# Altium project Neo-7M GNSS Evaluation Board.PrjPcb
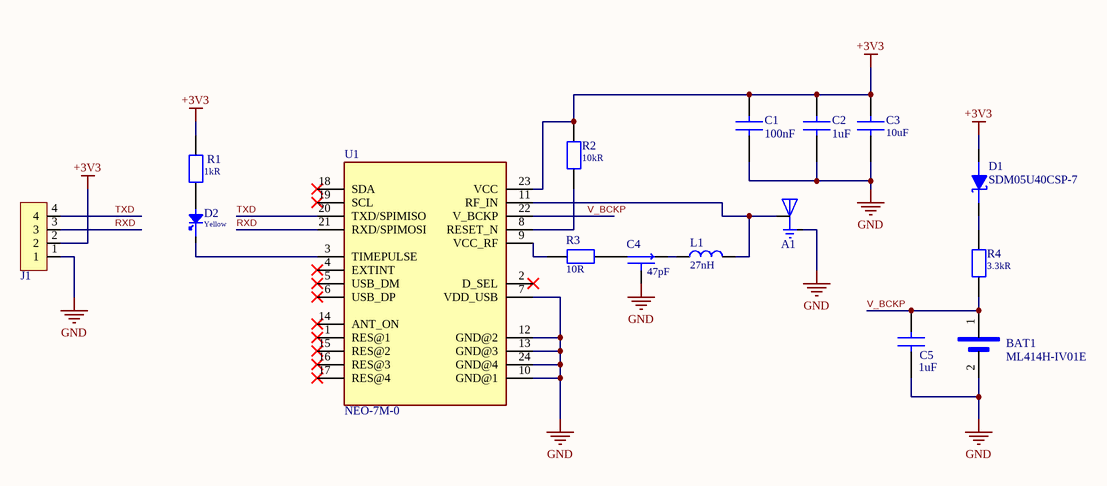
[diagram p0: NEO7M_EVAL.SchDoc]
1 sheet, 16 parts. Net scope: global (net labels, ports and power ports of the same name join across sheets).
Board file: NEO7M_EVAL.PcbDoc

## Sheet NEO7M_EVAL.SchDoc: NEO7M_SIMPLE
size A3; SheetNumber: 1; SheetTotal: 1

### Parts
A1  U.FL-R-SMT-1(10)  [HRS_U.FL-R-SMT-1(10)]  (value not drawn)
BAT1  ML414H-IV01E  [ML414H-IV01E]
C1  Capacitance: 100nF  [CAP CER 0603]  (hidden comment: C0603C104K5RAC7082)
C2  Capacitance: 1uF  [CAP CER 0805]  (hidden comment: CL21B105KOFNFNE)
C3  Capacitance: 10uF  [CAP CER 0805]  (hidden comment: GRM21BR61E106MA73L)
C4  Capacitance: 47pF  [CAP FEEDTRU 0805]  (hidden comment: W2F11A4708AT1A)
C5  Capacitance: 1uF  [CAP CER 0805]  (hidden comment: CL21B105KOFNFNE)
D1  SDM05U40CSP-7  [SDM05U40CSP-7]
D2  Color: Yellow  [LED GR 0603]  (hidden comment: APTD1608LSYCK/J3-PF)
J1  M20-9730445  [HDR_ML_1X4]  (value not drawn)
L1  Inductance: 27nH  [IND 0402]  (hidden comment: LQG15HS27NJ02D)
R1  Resistance: 1kR  [RES 0603]  (hidden comment: RC0603FR-071KL)
R2  Resistance: 10kR  [RES 0603]  (hidden comment: RC0603FR-0710KL)
R3  Resistance: 10R  [Res 0402]  (hidden comment: RK73H1ERTTP10R0F)
R4  Resistance: 3.3kR  [RES 0603]  (hidden comment: RC0603FR-073K3L)
U1  NEO-7M-0  [NEO-7M-0]

### Nets
+3V3: C1.2 C2.2 C3.2 D1.A J1.2 R1.2 R2.2 U1.23(VCC)
GND: A1.GND BAT1.2(NEG) C1.1 C2.1 C3.1 C4.3 C5.1 J1.1 U1.7(VDD_USB) U1.10(GND@1) U1.12(GND@2) U1.13(GND@3) U1.24(GND@4)
RXD: J1.3 U1.21(RXD/SPIMOSI)
TXD: J1.4 U1.20(TXD/SPIMISO)
V_BCKP: BAT1.1(POS) C5.2 R4.1 U1.22(V_BCKP)
NetA1_SIG: A1.SIG L1.2 U1.11(RF_IN)
NetC4_1: C4.1 R3.2
NetC4_2: C4.2 L1.1
NetD1_C: D1.C R4.2
NetD2_1: D2.1 U1.3(TIMEPULSE)
NetD2_2: D2.2 R1.1
NetR2_1: R2.1 U1.8(RESET_N)
NetR3_1: R3.1 U1.9(VCC_RF)

Not connected (* = marked no-connect by the designer): U1 1(RES@1)* 2(D_SEL)* 4(EXTINT)* 5(USB_DM)* 6(USB_DP)* 14(ANT_ON)* 15(RES@2)* 16(RES@3)* 17(RES@4)* 18(SDA)* 19(SCL)*

### Notes on the sheet
- ~
- Designed By:
- Page Name:
- Title:
- Variant:
- Page Size:
- Company:
- ApprovedBy:
- Date:
- Sheet:
- Revision:
- of

### Library data of the parts
A1 = U.FL-R-SMT-1(10): HIROSE(HRS) - U.FL-R-SMT-1(10) - RF COAXIAL, U.FL, STRAIGHT JACK, 50OHM; Body Material: Bronze; Body Plating: Silver; Dielectric Material: Polymer; Impedance: 50R; Connector Type: Coaxial,Receptacle,Male Pin; Frequency: 6GHz; Insulation Resistance: 500MR; Gender: Male; Supplier 1: Digi-Key; Manufacturer: Hirose; Manufacturer Part Number: U.FL-R-SMT-1(10); RoHS: Yes; Category: RF / Coaxial Connectors; Stock 1: 24998; Pricing 1: 2500=0.62974, 5000=0.60802, 12500=0.56459 (USD); Mount: Surface Mount,Through Hole,PCB; Contact Material: Brass,Bronze; Contact Plating: Gold; Housing Color: Beige; Min Operating Temperature: -40°C; Max Operating Temperature: 90°C; Termination: Solder; Orientation: Straight; Packaging: Tape and Reel; Package Quantity: 2500; Fastening Type: Snap; Max Frequency: 6GHz; Wire/Cable Type: Coaxial; Length: 3mm; Depth: 3.1mm; Radiation Hardening: No; REACH SVHC: No SVHC; Lead Free: Lead Free; ComponentLink1URL: https://datasheet.ciiva.com/11762/0900766b8105243f-11762474.pdf?src-supplier=RSComponents; ComponentLink1Description: https://datasheet.ciiva.com/11762/0900766b8105243f-11762474.pdf?src-supplier=RSComponents; ComponentLink2URL: https://datasheet.ciiva.com/7651/91524-7651914.pdf?src-supplier=Element14; ComponentLink2Description: https://datasheet.ciiva.com/7651/91524-7651914.pdf?src-supplier=Element14; ComponentLink3URL: https://datasheet.ciiva.com/7651/91524-7651915.pdf?src-supplier=Element14; ComponentLink3Description: https://datasheet.ciiva.com/7651/91524-7651915.pdf?src-supplier=Element14; Supplier Part Number 1: H11891TR-ND
BAT1 = ML414H-IV01E: BATTERY LITHIUM 3V RECHARGE; Manufacturer: Seiko; Supplier 1: Mouser; Manufacturer Part Number: ML414H-IV01E; RoHS: Yes; Category: Batteries and Accessories; Stock 1: 5581; Pricing 1: 1=1.82000, 10=1.63000, 50=1.45000, 100=1.27000, 1000=0.96600, 10000=0.81500 (USD); Weight: 0.007; Termination: SMD/SMT; Package Quantity: 1; Voltage Rating: 3V; Packaging: Tape and Reel; ComponentLink1URL: https://datasheet.ciiva.com/3/ml414h-e-3633.pdf?src-supplier=Digi-Key; ComponentLink1Description: https://datasheet.ciiva.com/3/ml414h-e-3633.pdf?src-supplier=Digi-Key; ComponentLink2URL: https://datasheet.ciiva.com/3/ml414h-e-3634.pdf?src-supplier=Digi-Key; ComponentLink2Description: https://datasheet.ciiva.com/3/ml414h-e-3634.pdf?src-supplier=Digi-Key; Supplier Part Number 1: 628-ML414H-IV01E
C1 = CAP CER 0.1UF 50V 0603: Cap Cer 0.1uF 50V 0603 10%; Manufacturer: KEMET; Dielectric Material: Ceramic; Dielectric: X7R; DesignedBy: ENES MERCAN; Supplier 1: Digi-Key; Manufacturer Part Number: C0603C104K5RAC7082; RoHS: Yes; Category: Ceramic Capacitors; Stock 1: 44787; Pricing 1: 1=0.12000, 10=0.08900, 50=0.04840, 100=0.03940, 500=0.02818, 1000=0.02214, 2500=0.02012, 5000=0.01852 (USD); Case/Package: 0603; Voltage Rating (DC): 50V; Tolerance: 10%; RoHS Compliant: Yes; Supplier Part Number 1: 399-C0603C104K5RAC7082CT-ND; Weight: 0.063
C2 C5 = CAP CER 1UF 16V 0805: CAP CER 1UF 16V X7R 0805; Manufacturer: Samsung; Tolerance: 10%; Supplier 1: Digi-Key; Manufacturer Part Number: CL21B105KOFNFNE; RoHS: Yes; Category: Ceramic Capacitors; Stock 1: 73789; Pricing 1: 1=0.12000, 10=0.08900, 50=0.04840, 100=0.03940, 500=0.02818, 1000=0.02214 (USD); Mount: Surface Mount; Case/Package: 0805; Case Code (Metric): 2012; Case Code (Imperial): 0805; Contact Plating: Tin; Min Operating Temperature: -55°C; Max Operating Temperature: 125°C; Package Quantity: 1; Packaging: Tape and Reel; Voltage Rating: 16V; Dielectric: X7R; Termination: Wraparound; Series: CL; Construction: Flat; Length: 0.079inch; Width: 0.049inch; Thickness: 0.053inch; RoHS Compliant: Yes; ComponentLink1URL: https://datasheet.ciiva.com/25713/cl21b105kofnfne-25713075.pdf?src-supplier=Digi-Key; ComponentLink1Description: https://datasheet.ciiva.com/25713/cl21b105kofnfne-25713075.pdf?src-supplier=Digi-Key; Supplier Part Number 1: 1276-2930-1-ND
C3 = CAP CER 10UF 25V 0805: MURATA - GRM21BR61E106MA73L - SMD Multilayer Ceramic Capacitor, 10 µF, 25 V, 0805 [2012 Metric], ± 20%, X5R, GRM Series; Voltage Rating: 25V; Supplier 1: Digi-Key; Manufacturer: Murata; Manufacturer Part Number: GRM21BR61E106MA73L; RoHS: Yes; Category: Ceramic Capacitors; Stock 1: 318119; Pricing 1: 1=0.26000, 10=0.17900, 50=0.11960, 100=0.10170, 500=0.07176, 1000=0.06279 (USD); Mount: Surface Mount; Case/Package: 0805; Case Code (Metric): 2012; Case Code (Imperial): 0805; Weight: 0.000335oz; Min Operating Temperature: -55°C; Max Operating Temperature: 85°C; Tolerance: 20%; Packaging: Tape and Reel; Dielectric: X5R; Termination: SMD/SMT; Resistor Type: Ceramic; Voltage Rating (DC): 25V; Package Quantity: 3000; Length: 2mm; Width: 0.049inch; Height: 1.25mm; Thickness: 0.055inch; Depth: 1.25mm; REACH SVHC: No SVHC; Lead Free: Lead Free; RoHS Compliant: Yes; ComponentLink1URL: http://www.farnell.com/datasheets/2079185.pdf?src-supplier=Farnell; ComponentLink1Description: http://www.farnell.com/datasheets/2079185.pdf?src-supplier=Farnell; ComponentLink2URL: http://www.mouser.com/ds/2/281/c02e-2905.pdf?src-supplier=Mouser; ComponentLink2Description: http://www.mouser.com/ds/2/281/c02e-2905.pdf?src-supplier=Mouser; ComponentLink3URL: http://components.arrow.com/part/dataview/0323_03061623?src-supplier=Arrow+Europe; ComponentLink3Description: http://components.arrow.com/part/dataview/0323_03061623?src-supplier=Arrow+Europe; ComponentLink4URL: https://search.murata.co.jp/Ceramy/image/img/A01X/G101/ENG/GRM21BR61E106MA73-01.pdf?src-supplier=Digi-Key; ComponentLink4Description: https://search.murata.co.jp/Ceramy/image/img/A01X/G101/ENG/GRM21BR61E106MA73-01.pdf?src-supplier=Digi-Key; ComponentLink5URL: http://www.farnell.com/datasheets/2079185.pdf?src-supplier=Element14; ComponentLink5Description: http://www.farnell.com/datasheets/2079185.pdf?src-supplier=Element14; Supplier Part Number 1: 490-10748-1-ND
C4 = CAP FT 47PF 100V 0805: CAP FEEDTHRU 47PF 100V 0805; Manufacturer: Kyocera AVX; Dielectric Material: Ceramic; Tolerance: 50%; Dielectric: C0G; Current Rating: 300mA; DC Resistance (DCR): 600mR; Insulation Resistance: 1GR; Supplier 1: Digi-Key; Manufacturer Part Number: W2F11A4708AT1A; RoHS: Yes; Category: Ceramic Capacitors; Stock 1: 19900; Pricing 1: 1=0.46000, 10=0.32200, 50=0.24380, 100=0.21240, 500=0.15730, 1000=0.13370 (USD); Mount: Surface Mount; Case/Package: 0805; Number of Pins: 4; Case Code (Metric): 2012; Case Code (Imperial): 0805; Min Operating Temperature: -55°C; Max Operating Temperature: 125°C; Voltage Rating: 100V; Package Quantity: 4000; Packaging: Tape and Reel; Voltage Rating (DC): 100V; Voltage: 100V; Current: 300mA; Termination: SMD/SMT; Series: W2F; Construction: Flat; Length: 2.01mm; Width: 0.049inch; Height: 0.045inch; Depth: 1.25mm; Radiation Hardening: No; Lead Free: Lead Free; RoHS Compliant: Yes; ComponentLink1URL: https://datasheet.ciiva.com/1011/w2fw3f-1011555.pdf?src-supplier=Digi-Key; ComponentLink1Description: https://datasheet.ciiva.com/1011/w2fw3f-1011555.pdf?src-supplier=Digi-Key; ComponentLink2URL: https://datasheet.ciiva.com/17490/w2fw3f-17490408.pdf?src-supplier=Avnet+Europe; ComponentLink2Description: https://datasheet.ciiva.com/17490/w2fw3f-17490408.pdf?src-supplier=Avnet+Europe; ComponentLink3URL: https://datasheet.ciiva.com/4932/w2fw3f-4932074.pdf?src-supplier=Mouser; ComponentLink3Description: https://datasheet.ciiva.com/4932/w2fw3f-4932074.pdf?src-supplier=Mouser; ComponentLink4URL: https://datasheet.ciiva.com/11516/w2fw3f-11516952.pdf?src-supplier=Avnet; ComponentLink4Description: https://datasheet.ciiva.com/11516/w2fw3f-11516952.pdf?src-supplier=Avnet; Supplier Part Number 1: 478-12987-1-ND
D1 = Schottky Diode GPS: DIODE SCHTKY 40V 500MA X3WLB1006; Manufacturer: Diodes; Capacitance: 3.5E-11F; Element Configuration: Single; Forward Voltage: 460mV; Max Forward Surge Current (Ifsm): 14A; Max Reverse Current: 75uA; Supplier 1: Digi-Key; Manufacturer Part Number: SDM05U40CSP-7; RoHS: Yes; Category: Rectifier Diodes; Stock 1: 221856; Pricing 1: 1=0.41000, 10=0.30800, 100=0.17440, 500=0.11550, 1000=0.08855, 2000=0.07700 (USD); Mount: Surface Mount; Number of Pins: 2; Min Operating Temperature: -55°C; Max Operating Temperature: 150°C; Packaging: Tape and Reel; Reverse Voltage (DC): 40V; Average Rectified Current: 500mA; Forward Current: 500mA; Max Repetitive Reverse Voltage (Vrrm): 40V; Package Quantity: 5000; Max Reverse Voltage (DC): 40V; RoHS Compliant: Yes; ComponentLink1URL: http://www.mouser.com/ds/2/115/SDM05U40CSP-520315.pdf?src-supplier=Mouser; ComponentLink1Description: http://www.mouser.com/ds/2/115/SDM05U40CSP-520315.pdf?src-supplier=Mouser; ComponentLink2URL: https://www.diodes.com/assets/Datasheets/SDM05U40CSP.pdf?src-supplier=Digi-Key; ComponentLink2Description: https://www.diodes.com/assets/Datasheets/SDM05U40CSP.pdf?src-supplier=Digi-Key; Supplier Part Number 1: SDM05U40CSP-7DIDKR-ND; Weight: 0.4
D2 = LED YLW 0603: LED YELLOW CLEAR 2SMD; Manufacturer: Kingbright; Lens Color: Colorless; Luminous Intensity: 55mcd; Test Current: 2mA; Viewing Angle: 60°; Dominant Wavelength: 590nm; Forward Voltage: 1.85V; Supplier 1: Digi-Key; Manufacturer Part Number: APTD1608LSYCK/J3-PF; RoHS: Yes; Category: LEDs; Stock 1: 32340; Pricing 1: 1=0.58000, 10=0.38200, 100=0.25300, 1000=0.19532 (USD); Mount: Surface Mount; Case/Package: 0603; Case Code (Metric): 1608; Case Code (Imperial): 0603; Packaging: Tape and Reel; Lens Transparency: Clear; Length: 1.6mm; Width: 0.8mm; Height: 0.95mm; RoHS Compliant: No; ComponentLink1URL: http://www.mouser.com/ds/2/216/APTD1608LSYCK-J3-PF-535613.pdf?src-supplier=Mouser; ComponentLink1Description: http://www.mouser.com/ds/2/216/APTD1608LSYCK-J3-PF-535613.pdf?src-supplier=Mouser; ComponentLink2URL: http://www.kingbrightusa.com/images/catalog/SPEC/APTD1608LSYCK-J3-PF.pdf?src-supplier=Digi-Key; ComponentLink2Description: http://www.kingbrightusa.com/images/catalog/SPEC/APTD1608LSYCK-J3-PF.pdf?src-supplier=Digi-Key; Supplier Part Number 1: 754-1947-1-ND; Weight: 0.0025
J1 = HDR_ML_1X4: Headers & Wire Housings 04 SIL VERTICAL PIN HEADER GOLD HT; Manufacturer: Harwin; Number of Contacts: 4; Max Current Rating: 3A; Contact Resistance: 25mR; Voltage Rating: 750V; Gender: Male; Connector Type: Male Pin; Pitch: 2.54mm; Supplier 1: Digi-Key; Manufacturer Part Number: M20-9730445; RoHS: Yes; Category: Headers and Wire Housings; Stock 1: 2723; Pricing 1: 1=0.25000, 10=0.23900, 100=0.16540, 500=0.13998, 1000=0.11453, 5000=0.10181, 10000=0.09226 (USD); Mount: Through Hole; Case/Package: SIL; Contact Plating: Gold; Contact Material: Brass; Color: Black; Housing Color: Black; Housing Material: Nylon; Min Operating Temperature: -40°C; Max Operating Temperature: 105°C; Number of Rows: 1; Termination: Solder; Current Rating: 3A; Package Quantity: 1000; Packaging: Bulk; Number of Positions: 4; Orientation: Straight; Series: M20; Contact Type: Male Pin; Length: 10.16mm; Contact Mating Length: 0.276inch; Depth: 2.54mm; Radiation Hardening: No; RoHS Compliant: Yes; ComponentLink1URL: https://datasheet.ciiva.com/16733/m20-973-16733567.pdf?src-supplier=Avnet+Europe; ComponentLink1Description: https://datasheet.ciiva.com/16733/m20-973-16733567.pdf?src-supplier=Avnet+Europe; Supplier Part Number 1: 952-3273-ND; Weight: 0.244
L1 = IND 27nH 0402: Inductor RF Chip Multi-Layer 27nH 5% 100MHz 8Q-Factor Air 300mA 460mOhm DCR 0402 Paper T/R; Manufacturer: Murata; DC Resistance (DCR): 460mR; Shielding: Unshielded; Self Resonant Frequency: 1.7GHz; Q Factor: 8; Supplier 1: Digi-Key; Manufacturer Part Number: LQG15HS27NJ02D; RoHS: Yes; Category: Fixed Inductors; Stock 1: 103641; Pricing 1: 1=0.10000, 10=0.05500, 25=0.04920, 50=0.04180, 100=0.03690, 250=0.03380, 500=0.03072, 1000=0.02580, 2500=0.02211 (USD); Mount: Surface Mount; Case/Package: 0402; Core Material: Air; Case Code (Metric): 1005; Case Code (Imperial): 0402; Min Operating Temperature: -55°C; Max Operating Temperature: 125°C; Tolerance: 5%; Max DC Current: 300mA; Package Quantity: 10000; Current Rating: 300mA; Packaging: Tape and Reel; Inductance Tolerance: 5%; Test Frequency: 100MHz; Termination: SMD/SMT; DC Current: 300mA; Series: LQG15HS; Rated Current-Max: 300mA; Length: 1mm; Width: 0.02inch; Height: 0.5mm; Height - Seated (Max): 0.022inch; Depth: 0.55mm; REACH SVHC: No SVHC; Military Standard: Not; Lead Free: Lead Free; RoHS Compliant: Yes; ComponentLink1URL: https://datasheet.ciiva.com/11799/0900766b80f10809-11799242.pdf?src-supplier=RSComponents; ComponentLink1Description: https://datasheet.ciiva.com/11799/0900766b80f10809-11799242.pdf?src-supplier=RSComponents; ComponentLink2URL: https://datasheet.ciiva.com/1038/l0075s0083lqg15hs-1038145.pdf?src-supplier=Digi-Key; ComponentLink2Description: https://datasheet.ciiva.com/1038/l0075s0083lqg15hs-1038145.pdf?src-supplier=Digi-Key; ComponentLink3URL: https://datasheet.ciiva.com/1038/l0075s0083lqg15hs-1038146.pdf?src-supplier=Digi-Key; ComponentLink3Description: https://datasheet.ciiva.com/1038/l0075s0083lqg15hs-1038146.pdf?src-supplier=Digi-Key; ComponentLink4URL: https://datasheet.ciiva.com/1038/l0075s0083lqg15hs-1038147.pdf?src-supplier=Digi-Key; ComponentLink4Description: https://datasheet.ciiva.com/1038/l0075s0083lqg15hs-1038147.pdf?src-supplier=Digi-Key; ComponentLink5URL: https://datasheet.ciiva.com/3082/l0075s0083lqg15hs-3082179.pdf?src-supplier=Avnet; ComponentLink5Description: https://datasheet.ciiva.com/3082/l0075s0083lqg15hs-3082179.pdf?src-supplier=Avnet; ComponentLink6URL: https://datasheet.ciiva.com/16360/l0075s0083lqg15hs-16360143.pdf?src-supplier=Future+Electronics; ComponentLink6Description: https://datasheet.ciiva.com/16360/l0075s0083lqg15hs-16360143.pdf?src-supplier=Future+Electronics; ComponentLink7URL: https://datasheet.ciiva.com/17247/l0075s0083lqg15hs-17247119.pdf?src-supplier=Avnet+Europe; ComponentLink7Description: https://datasheet.ciiva.com/17247/l0075s0083lqg15hs-17247119.pdf?src-supplier=Avnet+Europe; Supplier Part Number 1: 490-2628-6-ND
R1 = RES 1KR 0603: RES SMD 1K OHM 1% 1/10W 0603; Manufacturer: Yageo; Temperature Coefficient: 100ppm/°C; Power Rating: 100mW; Voltage Rating: 50V; Supplier 1: Digi-Key; Manufacturer Part Number: RC0603FR-071KL; RoHS: Yes; Category: Chip SMD Resistors; Stock 1: 12963545; Pricing 1: 1=0.10000, 10=0.02400, 100=0.00970, 1000=0.00436, 2500=0.00378 (USD); Case/Package: 0603; Contact Plating: Tin,Matte; Case Code (Imperial): 0603; Case Code (Metric): 1608; Size Code: 0603; Min Operating Temperature: -55°C; Max Operating Temperature: 155°C; Tolerance: 1%; Resistor Type: Thick Film; Packaging: Tape and Reel; Termination: SMD/SMT; Features: Moisture Resistant; Series: RC; Max Power Dissipation: 100mW; Number of Terminations: 2; Technology: THICK FILM; Resistance Tolerance: 1%; Construction: Rectangular; Length: 1.6mm; Height: 0.45mm; Depth: 0.8mm; Radiation Hardening: No; REACH SVHC: No SVHC; Lead Free: Lead Free; Military Standard: Not; RoHS Compliant: Yes; Supplier Part Number 1: 311-1.00KHRCT-ND; Weight: 0.016
R2 = RES 10K 0603: Res General Purpose Thick Film 0603 10K Ohm 1% 1/10W ±100ppm/°C Molded SMD Paper T/R; Manufacturer: Yageo; Voltage Rating (DC): 50V; Power Rating: 100mW; Voltage Rating: 75V; Supplier 1: Digi-Key; Manufacturer Part Number: RC0603FR-0710KL; RoHS: Yes; Category: Chip SMD Resistors; Stock 1: 17970648; Pricing 1: 1=0.10000, 10=0.02400, 100=0.00970, 1000=0.00436, 2500=0.00378 (USD); Case/Package: 0603; Number of Pins: 2; Case Code (Imperial): 0603; Case Code (Metric): 1608; Weight: 0.002; Size Code: 0603; Min Operating Temperature: -55°C; Max Operating Temperature: 155°C; Tolerance: 1%; Resistor Type: Thick Film; Temperature Coefficient: 100ppm/°C; Packaging: Tape and Reel; Termination: SMD/SMT; Features: Moisture Resistant; Series: RC; Max Power Dissipation: 100mW; Number of Terminations: 2; Resistance Tolerance: 1%; Construction: Rectangular; Length: 1.6mm; Width: 0.8mm; Height: 0.45mm; Depth: 0.8mm; Lead Pitch: 0.3mm; REACH SVHC: Unknown; Lead Free: Lead Free; Military Standard: Not; RoHS Compliant: Yes; ComponentLink1URL: https://datasheet.ciiva.com/7660/38590-7660789.pdf?src-supplier=Element14; ComponentLink1Description: https://datasheet.ciiva.com/7660/38590-7660789.pdf?src-supplier=Element14; ComponentLink2URL: https://datasheet.ciiva.com/7983/443971-7983596.pdf?src-supplier=Element14; ComponentLink2Description: https://datasheet.ciiva.com/7983/443971-7983596.pdf?src-supplier=Element14; ComponentLink3URL: https://datasheet.ciiva.com/22747/443971-22747519.pdf?src-supplier=Element14; ComponentLink3Description: https://datasheet.ciiva.com/22747/443971-22747519.pdf?src-supplier=Element14; ComponentLink4URL: https://datasheet.ciiva.com/46440/1868787-46440891.pdf?src-supplier=Element14; ComponentLink4Description: https://datasheet.ciiva.com/46440/1868787-46440891.pdf?src-supplier=Element14; ComponentLink5URL: https://datasheet.ciiva.com/7746/1738695-7746239.pdf?src-supplier=Element14; ComponentLink5Description: https://datasheet.ciiva.com/7746/1738695-7746239.pdf?src-supplier=Element14; ComponentLink6URL: https://datasheet.ciiva.com/15189/getdatasheetpartid-409289-15189591.pdf?src-supplier=Verical; ComponentLink6Description: https://datasheet.ciiva.com/15189/getdatasheetpartid-409289-15189591.pdf?src-supplier=Verical; Supplier Part Number 1: 311-10.0KHRCT-ND
R3 = RES 10R 0402: Thick Film Resistors - SMD Anti Sulfur 0.5 Tol. 0402 -55oC to 155oC; Manufacturer: KOA Speer; Power Rating: 63mW; Tolerance: 1%; Voltage Rating: 50V; Temperature Coefficient: 100ppm/°C; Supplier 1: Digi-Key; Manufacturer Part Number: RK73H1ERTTP10R0F; RoHS: Yes; Category: Chip SMD Resistors; Stock 1: 108727; Pricing 1: 1=0.14000, 10=0.12700, 100=0.04890, 1000=0.02150, 2500=0.01857, 5000=0.01662 (USD); Case/Package: 0402; Case Code (Imperial): 0402; Case Code (Metric): 1005; Weight: 2.3E-05oz; Min Operating Temperature: -55°C; Max Operating Temperature: 155°C; Packaging: Tape and Reel; Package Quantity: 10000; Termination: SMD/SMT; Length: 1mm; Width: 0.5mm; Height: 0.35mm; ComponentLink1URL: http://www.mouser.com/ds/2/219/RK73H-5715.pdf?src-supplier=Mouser; ComponentLink1Description: http://www.mouser.com/ds/2/219/RK73H-5715.pdf?src-supplier=Mouser; Supplier Part Number 1: 2019-RK73H1ERTTP10R0FCT-ND
R4 = RES 3K3R 0603: YAGEO - RC0603FR-073K3L - SMD Chip Resistor, 0603 [1608 Metric], 3.3 kohm, RC Series, 75 V, Thick Film, 100 mW; Tolerance: 1%; Temperature Coefficient: 100ppm/°C; Voltage Rating (DC): 50V; Power Rating: 100mW; Supplier 1: Digi-Key; Manufacturer: Yageo; Manufacturer Part Number: RC0603FR-073K3L; RoHS: Yes; Category: Chip SMD Resistors; Stock 1: 789417; Pricing 1: 1=0.10000, 10=0.02400, 100=0.00970, 1000=0.00436, 2500=0.00378 (USD); Case/Package: 0603; Number of Pins: 2; Case Code (Imperial): 0603; Case Code (Metric): 1608; Size Code: 0603; Min Operating Temperature: -55°C; Max Operating Temperature: 155°C; Packaging: Tape and Reel; Resistor Type: Thick Film; Voltage Rating: 50V; Package Quantity: 1; Termination: SMD/SMT; Number of Terminations: 2; Max Power Dissipation: 100mW; Features: Moisture Resistant; Series: RC; Resistance Tolerance: 1%; Construction: Rectangular; Length: 1.6mm; Width: 0.8mm; Height: 0.022inch; Depth: 0.8mm; REACH SVHC: No SVHC; Lead Free: Lead Free; Military Standard: Not; RoHS Compliant: Yes; Supplier Part Number 1: 311-3.30KHRDKR-ND; Weight: 0.016
U1 = NEO-7M-0: series RF Receiver GLONASS, GNSS, GPS 1.575GHz -161dBm - - -; Manufacturer: u-blox; Interface: I2C,SPI,USB,UART; Supplier 1: Digi-Key; Manufacturer Part Number: NEO-7M-0; RoHS: Yes; Category: RF Receivers, Transceivers; Pricing 1: 1=26.50000, 10=25.70000, 50=21.08000, 100=16.88010 (USD); Case/Package: SMD/SMT; Min Operating Temperature: -40°C; Max Operating Temperature: 85°C; Packaging: Tape and Reel; Frequency: 1.575GHz; Sensitivity: -161dBm; ComponentLink1URL: https://www.u-blox.com/sites/default/files/products/documents/NEO-7_DataSheet_%28UBX-13003830%29.pdf?src-supplier=Digi-Key; ComponentLink1Description: https://www.u-blox.com/sites/default/files/products/documents/NEO-7_DataSheet_%28UBX-13003830%29.pdf?src-supplier=Digi-Key; Supplier Part Number 1: 672-NEO-7M-0CT-ND